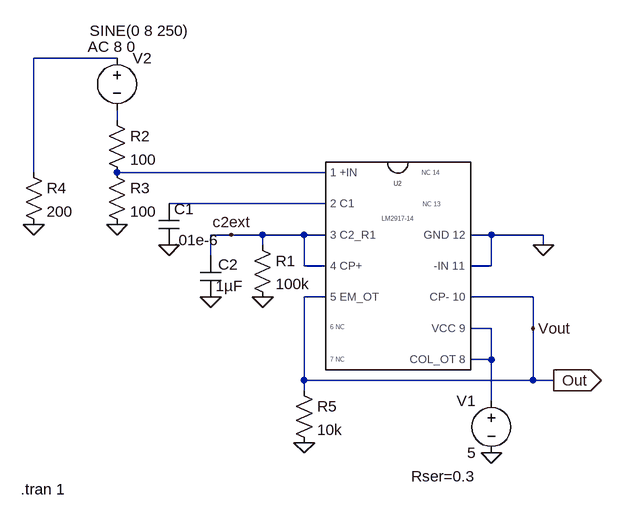
[diagram p0: schematic LM2917-14 myESC.asc]
LM2917-14 myESC.asc, the LTspice schematic file:
Version 4
SHEET 1 1572 772
WIRE 128 -672 0 -672
WIRE 128 -576 128 -592
WIRE 0 -496 0 -672
WIRE 448 -496 128 -496
WIRE 448 -448 208 -448
WIRE 304 -400 272 -400
WIRE 352 -400 304 -400
WIRE 416 -400 352 -400
WIRE 448 -400 416 -400
WIRE 704 -400 672 -400
WIRE 784 -400 704 -400
WIRE 352 -384 352 -400
WIRE 784 -384 784 -400
WIRE 272 -368 272 -400
WIRE 416 -352 416 -400
WIRE 448 -352 416 -352
WIRE 704 -352 704 -400
WIRE 704 -352 672 -352
WIRE 448 -304 416 -304
WIRE 768 -304 672 -304
WIRE 704 -256 672 -256
WIRE 768 -256 768 -304
WIRE 704 -208 704 -256
WIRE 704 -208 672 -208
WIRE 416 -176 416 -304
WIRE 768 -176 768 -256
WIRE 768 -176 416 -176
WIRE 800 -176 768 -176
WIRE 416 -160 416 -176
WIRE 704 -144 704 -208
FLAG 704 -64 0
FLAG 784 -384 0
FLAG 0 -416 0
FLAG 352 -304 0
FLAG 272 -304 0
FLAG 416 -80 0
FLAG 128 -416 0
FLAG 304 -400 c2ext
FLAG 800 -176 Out
IOPIN 800 -176 Out
FLAG 768 -256 Vout
FLAG 208 -384 0
SYMBOL voltage 704 -160 M0
WINDOW 123 0 0 Left 2
WINDOW 39 24 132 Left 2
SYMATTR SpiceLine Rser=0.3
SYMATTR InstName V1
SYMATTR Value 5
SYMBOL cap 256 -368 R0
WINDOW 0 28 14 Left 2
WINDOW 3 24 47 Left 2
SYMATTR InstName C2
SYMATTR Value 1µF
SYMBOL res 336 -400 R0
SYMATTR InstName R1
SYMATTR Value 100k
SYMBOL res 400 -176 R0
SYMATTR InstName R5
SYMATTR Value 10k
SYMBOL voltage 128 -688 R0
WINDOW 3 -42 -26 Left 2
WINDOW 123 -45 -2 Left 2
WINDOW 39 0 0 Left 2
SYMATTR Value SINE(0 8 250)
SYMATTR Value2 AC 8 0
SYMATTR InstName V2
SYMBOL res 112 -592 R0
SYMATTR InstName R2
SYMATTR Value 100
SYMBOL res 112 -512 R0
SYMATTR InstName R3
SYMATTR Value 100
SYMBOL res -16 -512 R0
SYMATTR InstName R4
SYMATTR Value 200
SYMBOL cap 192 -448 R0
SYMATTR InstName C1
SYMATTR Value .01e-6
SYMBOL Misc\\LM2917-14 560 -352 R0
SYMATTR InstName U2
TEXT -20 -8 Left 2 !.tran 1

The netlist it stands for:
* LM2917-14 myESC.asc
V1 N005 0 5 Rser=0.3
C2 c2ext 0 1µF
R1 c2ext 0 100k
R5 Vout 0 10k
V2 N001 N002 SINE(0 8 250) AC 8 0
R2 N002 N003 100
R3 N003 0 100
R4 N001 0 200
C1 N004 0 .01e-6
XU2 N003 0 N004 c2ext c2ext Vout Vout N005 N005 0 LM2917-14  ; pins 1_+IN -IN_11 2_C1 3_C2_R1 4_CP+ CP-_10 5_EM_OT COL_OT_8 VCC_9 GND_12
.tran 1
.lib LM29x7.sub
.backanno
.end